# EAGLE design tms-rgb-jig (EAGLE 9.5.1)
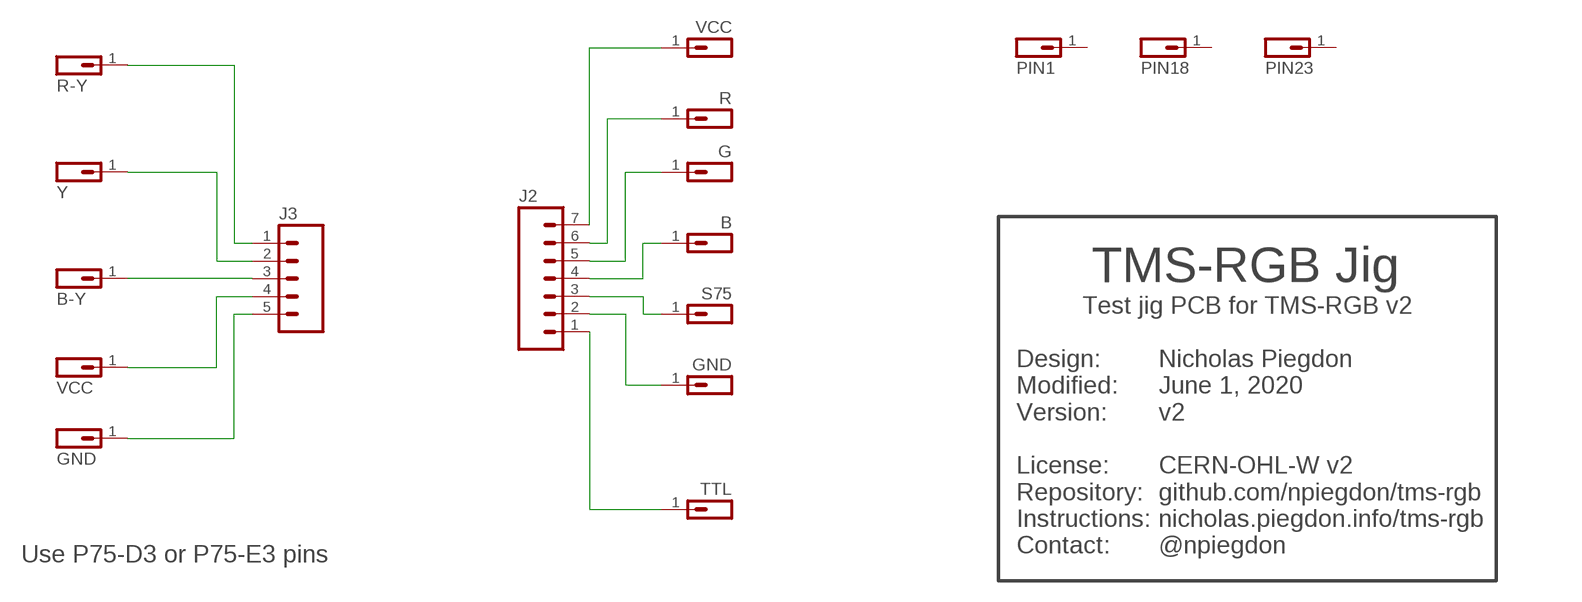
[diagram p0: schematic, sheet 1]

## Parts
J2  CONN_07  [1X07]
J3  CONN_05  [1X05]
J4  R-Y  CONN_POGO  [POGO]
J5  B-Y  CONN_POGO  [POGO]
J6  Y  CONN_POGO  [POGO]
J7  VCC  CONN_POGO  [POGO]
J8  GND  CONN_POGO  [POGO]
J9  VCC  CONN_POGO  [POGO]
J10  R  CONN_POGO  [POGO]
J11  G  CONN_POGO  [POGO]
J12  B  CONN_POGO  [POGO]
J13  S75  CONN_POGO  [POGO]
J14  GND  CONN_POGO  [POGO]
J15  TTL  CONN_POGO  [POGO]
J16  PIN1  CONN_POGO  [POGO]
J17  PIN18  CONN_POGO  [POGO]
J18  PIN23  CONN_POGO  [POGO]

## Nets
N$1: J3.1 J4.1
N$2: J3.2 J6.1
N$3: J3.3 J5.1
N$4: J3.4 J7.1
N$5: J3.5 J8.1
N$6: J2.7 J9.1
N$7: J2.6 J10.1
N$8: J2.5 J11.1
N$9: J2.4 J12.1
N$10: J2.3 J13.1
N$11: J2.2 J14.1
N$12: J2.1 J15.1
Unconnected: J16.1 J17.1 J18.1

## Notes on the sheet
- TMS-RGB Jig
- Test jig PCB for TMS-RGB v2
- Design:
  Modified:
  Version:
  
  License:
  Repository:
  Instructions:
  Contact:
- Nicholas Piegdon
  June 1, 2020
  v2
  
  CERN-OHL-W v2
  github.com/npiegdon/tms-rgb
  nicholas.piegdon.info/tms-rgb
  @npiegdon
- Use P75-D3 or P75-E3 pins

## Library data of the parts
J2 = tms-rgb-jig:CONN_07
J3 = tms-rgb-jig:CONN_05
J4-J18 = tms-rgb-jig:CONN_POGO: For P75-series spring-loaded pins

## Board
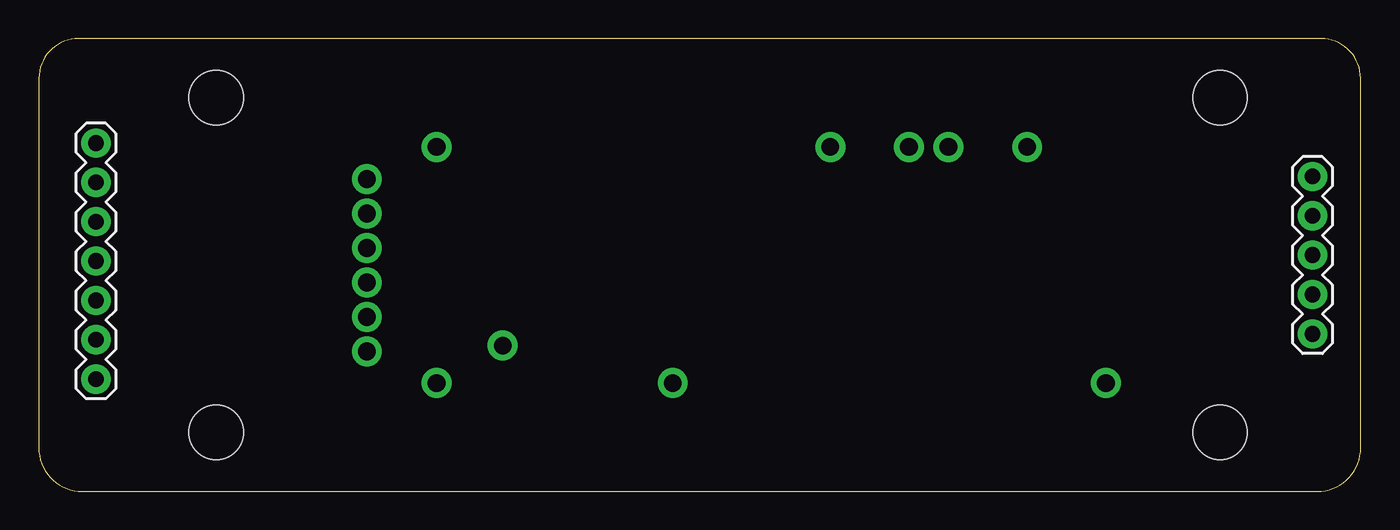
[diagram p1: board, top side]
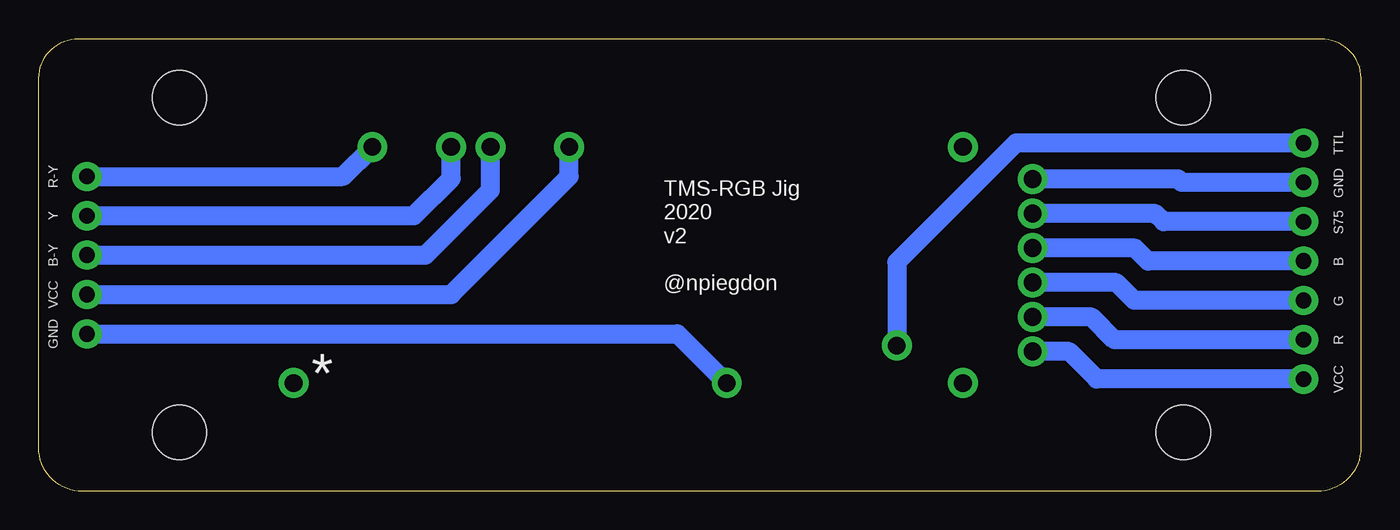
[diagram p2: board, bottom side, seen from below]

Size 85.29 x 29.21 mm. Coordinates in mm from the lower left corner, seen from the top.
Outline: 85.28,3.06 85.28,26.67 arc90 82.74,29.21 2.55,29.21 arc90 0.01,26.67 0.01,3.06 arc90 2.55,0 82.74,0 arc90 85.28,3.06
Copper layers (1*16): Top 0.035559375mm / dielectric 1.6mm / Bottom 0.035559375mm
Design rules "oshpark-2layer-tented": minimum track width 6mil, minimum drill 10mil, track to track 6mil, track to pad 6mil, pad to pad 6mil, via to via 6mil, smd to smd 6mil, copper to edge 15mil, drill to drill 6mil, minimum pad ring 5mil, minimum via ring 5mil, stop-mask expansion 2.5mil, vias tented up to drill 20mil, thermal gap 10mil
Holes 3.5 mm at 11.44,3.81 11.44,25.4 76.21,3.81 76.21,25.4

### Footprints (pad centres in the part's own frame; a part is rotated, then mirrored left to right if it is on the bottom)
1X07 = drill 1.016 pad 1.88: 1 0,0; 2 2.54,0; 3 5.08,0; 4 7.62,0; 5 10.16,0; 6 12.7,0; 7 15.24,0
1X05 = drill 1.016 pad 1.88: 1 0,0; 2 2.54,0; 3 5.08,0; 4 7.62,0; 5 10.16,0
POGO = drill 1.143 pad 1.93: 1 0,0

### Placement (x,y rotation side)
J2  3.69,22.48 270 top
J3  82.18,20.32 270 top
J4  63.77,22.23 180 top
J5  56.15,22.23 180 top
J6  58.69,22.23 180 top
J7  51.07,22.23 180 top
J8  40.91,6.99 180 top
J9  21.17,9.02 180 top
J10  21.17,11.24 180 top
J11  21.17,13.47 180 top
J12  21.17,15.7 180 top
J13  21.17,17.92 180 top
J14  21.17,20.15 180 top
J15  29.93,9.4 180 top
J16  68.85,6.99 180 top
J17  25.67,6.99 0 top
J18  25.67,22.23 0 top

### Tracks (layer width: path | path; a pad name or v marks a point on that pad's centre or on a via)
N$1
  Bottom 1.219: J3.1 65.67,20.32 J4.1
N$2
  Bottom 1.219: J3.2 61.1,17.78 58.69,20.19 J6.1
N$3
  Bottom 1.219: J3.3 60.34,15.24 56.15,19.43 J5.1
N$4
  Bottom 1.219: J3.4 58.69,12.7 51.07,20.32 J7.1
N$5
  Bottom 1.219: J8.1 44.08,10.16 J3.5
N$6
  Bottom 1.219: J2.7 17.03,7.24 18.81,9.02 J9.1
N$7
  Bottom 1.219: J2.6 15.89,9.78 17.35,11.24 J10.1
N$8
  Bottom 1.219: J2.5 14.62,12.32 15.77,13.47 J11.1
N$9
  Bottom 1.219: J2.4 13.73,14.86 14.57,15.7 J12.1
N$10
  Bottom 1.219: J2.3 12.71,17.4 13.24,17.92 J13.1
N$11
  Bottom 1.219: J2.2 11.57,19.94 11.78,20.15 J14.1
N$12
  Bottom 1.219: J2.1 22.24,22.48 29.93,14.78 J15.1

### Text on the board
bPlace: *
bNames: TMS-RGB Jig / 2020 / v2 / / @npiegdon